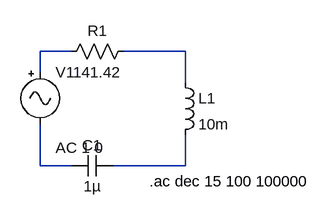
[diagram p0: schematic P1d.asc]
P1d.asc, the LTspice schematic file:
Version 4.1
SHEET 1 880 680
WIRE 128 32 80 32
WIRE 304 32 208 32
WIRE 80 64 80 32
WIRE 304 80 304 32
WIRE 80 208 80 144
WIRE 128 208 80 208
WIRE 304 208 304 160
WIRE 304 208 192 208
SYMBOL cap 192 192 R90
WINDOW 0 0 32 VBottom 2
WINDOW 3 32 32 VTop 2
SYMATTR InstName C1
SYMATTR Value 1µ
SYMBOL res 224 16 R90
WINDOW 0 0 56 VBottom 2
WINDOW 3 32 56 VTop 2
SYMATTR InstName R1
SYMATTR Value 141.42
SYMBOL ind 288 64 R0
SYMATTR InstName L1
SYMATTR Value 10m
SYMATTR SpiceLine Rser=1m
SYMBOL Misc\\signal 80 48 R0
WINDOW 123 24 132 Left 2
WINDOW 39 0 0 Left 0
SYMATTR InstName V1
SYMATTR Value ""
SYMATTR Value2 AC 1 0
TEXT 248 232 Left 2 !.ac dec 15 100 100000

The netlist it stands for:
* P1d.asc
C1 N004 N003 1µ
R1 N002 N001 141.42
L1 N002 N004 10m Rser=1m
V1 N001 N003 AC 1 0
.ac dec 15 100 100000
.backanno
.end